# Altium schematic sheet Audio-Beamformer_HMI_V1.0.SchDoc: Audio-Beamformer
size A4; PageSetup: Record=PageOptions|CenterHorizontal=True|CenterVertical=True|PrintScale=0.97|XCorrection=1.00|YCorrection=1.00|PrintKind=0|BorderSize=5000000|LeftOffset=0|BottomOffset=0|Orientation=2|PaperLength=1000|PaperWidth=1000|Scale=100|PaperSource=7|PrintQuality=-3|MediaType=1|DitherType=10|PrintScaleMode=1|PaperKind=A4|PaperIndex=9; Organization: Ostschweizer Fachhochschule; Address2: Florian Baumgartner & Thierry Schwaller; Address3: florian.baumgartner@ost.ch; DocumentNumber: 8; Revision: V1.0; SheetNumber: 8; SheetTotal: 10; Author: Florian Baumgartner & Thierry Schwaller; Subtitle: HMI
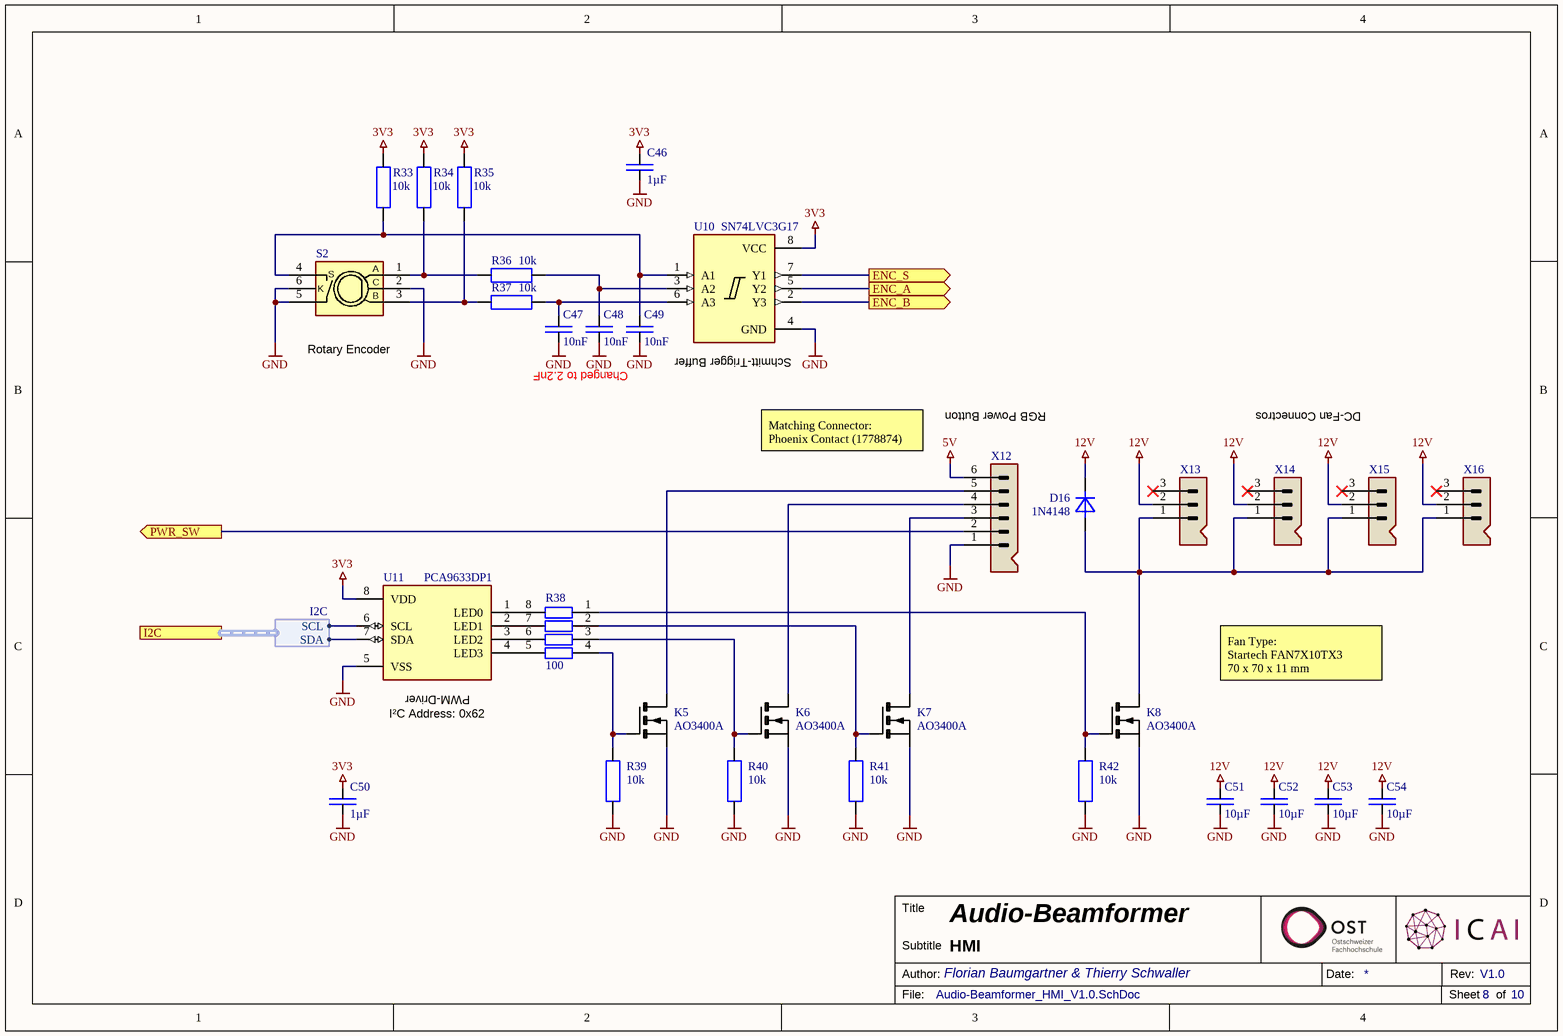
[diagram p0: Audio-Beamformer_HMI_V1.0.SchDoc]

## Parts
C46  1µF  [SMD Keramikkondensator 0603]
C47  10nF  [SMD Keramikkondensator 0603]
C48  10nF  [SMD Keramikkondensator 0603]
C49  10nF  [SMD Keramikkondensator 0603]
C50  1µF  [SMD Keramikkondensator 0603]
C51  10µF  [SMD Keramikkondensator 1206]
C52  10µF  [SMD Keramikkondensator 1206]
C53  10µF  [SMD Keramikkondensator 1206]
C54  10µF  [SMD Keramikkondensator 1206]
D16  1N4148  [SMD Diode SOD-123]
K5  AO3400A  [SMD MOSFET SOT-23]
K6  AO3400A  [SMD MOSFET SOT-23]
K7  AO3400A  [SMD MOSFET SOT-23]
K8  AO3400A  [SMD MOSFET SOT-23]
R33  10k  [SMD Widerstand 0603]
R34  10k  [SMD Widerstand 0603]
R35  10k  [SMD Widerstand 0603]
R36  10k  [SMD Widerstand 0603]
R37  10k  [SMD Widerstand 0603]
R38  100  [SMD Widerstand Array 4-Fach 0603]
R39  10k  [SMD Widerstand 0603]
R40  10k  [SMD Widerstand 0603]
R41  10k  [SMD Widerstand 0603]
R42  10k  [SMD Widerstand 0603]
S2  PEC11R-4025F-S0024  [THT Rotary Encoder with Switch]  (value not drawn)
U10  SN74LVC3G17  [SMD IC SM-8]
U11  PCA9633DP1  [SMD IC TSSOP-8]
X12  Board-To-Wire Connector (Receptacle)  [THT Connector 2.5mm 6-Pol (1778667)]  (value not drawn)
X13  Stiftleiste (3-Fach)  [THT Connector 2.54mm 3-Pol (61900311021)]  (value not drawn)
X14  Stiftleiste (3-Fach)  [THT Connector 2.54mm 3-Pol (61900311021)]  (value not drawn)
X15  Stiftleiste (3-Fach)  [THT Connector 2.54mm 3-Pol (61900311021)]  (value not drawn)
X16  Stiftleiste (3-Fach)  [THT Connector 2.54mm 3-Pol (61900311021)]  (value not drawn)

## Ports
ENC_A (out), ENC_B (out), ENC_S (out), I2C (harness I2C), PWR_SW (out)

## Harnesses
I2C: SCL, SDA

## Nets
3V3: C46.2 C50.2 R33.2 R34.2 R35.2 U10.8(VCC) U11.8(VDD)
5V: X12.6
12V: C51.2 C52.2 C53.2 C54.2 D16.K X13.2 X14.2 X15.2 X16.2
GND: C46.1 C47.1 C48.1 C49.1 C50.1 C51.1 C52.1 C53.1 C54.1 K5.S K6.S K7.S K8.S R39.1 R40.1 R41.1 R42.1 S2.2(C) S2.5(S) S2.6(K) U10.4(GND) U11.5(VSS) X12.1
ENC_A: U10.5(Y2) ; port ENC_A
ENC_B: U10.2(Y3) ; port ENC_B
ENC_S: U10.7(Y1) ; port ENC_S
PWR_SW: X12.2 ; port PWR_SW
NetC47_2: C47.2 R37.1 U10.6(A3)
NetC48_2: C48.2 R36.1 U10.3(A2)
NetC49_2: C49.2 R33.1 S2.4(S) U10.1(A1)
NetD16_A: D16.A K8.D X13.1 X14.1 X15.1 X16.1
NetK5_D: K5.D X12.5
NetK5_G: K5.G R38.4 R39.2
NetK6_D: K6.D X12.4
NetK6_G: K6.G R38.3 R40.2
NetK7_D: K7.D X12.3
NetK7_G: K7.G R38.2 R41.2
NetK8_G: K8.G R38.1 R42.2
NetR34_1: R34.1 R36.2 S2.1(A)
NetR35_1: R35.1 R37.2 S2.3(B)
NetR38_5: R38.5 U11.4(LED3)
NetR38_6: R38.6 U11.3(LED2)
NetR38_7: R38.7 U11.2(LED1)
NetR38_8: R38.8 U11.1(LED0)
NetU11_6: U11.6(SCL) ; port I2C.SCL
NetU11_7: U11.7(SDA) ; port I2C.SDA

Not connected (* = marked no-connect by the designer): X13 3*; X14 3*; X15 3*; X16 3*

## Notes on the sheet
- (near S2) Rotary Encoder
- Changed to 2.2nF
- Schmitt-Trigger Buffer
- Matching Connector:
  Phoenix Contact (1778874)
- RGB Power Button
- DC-Fan Connectros
- (near U11) PWM-Driver
- (near U11) I²C Address: 0x62
- Fan Type:
  Startech FAN7X10TX3
  70 x 70 x 11 mm
- Title
- Author:
- Subtitle
- Date:
- Rev:
- File:
- Sheet
- of

## Library data of the parts
C46 C50 = C-CAPACITOR: CAP-MK; Component Description: Multilayer Ceramic Capacitors; Component Value: 1µF 50V; Digikey: 1276-1860-1-ND; Farnell: 3013383; Mouser: 187-CL10A105KB8NNNC; JLC-Parts: C15849; Unit Price: 0.01
C47-C49 = C-CAPACITOR: CAP-MK; Component Description: Multilayer Ceramic Capacitors; Component Value: 10nF 50V; Digikey: 445-5662-1-ND; Farnell: 2346966; Mouser: 77-VJ0603V103ZXAPBC; JLC-Parts: C57112; Unit Price: 0.01
C51-C54 = C-CAPACITOR: CAP-MK; Component Description: Multilayer Ceramic Capacitors; Component Value: 10µF 50V; Digikey: 445-7886-1-ND; Farnell: 2211092; Mouser: 810-CGA5L3X5R1H106K; JLC-Parts: C13585; Unit Price: 0.27
D16 = R-DIODE: DIODE (alt V); Component Description: Fast Switching Diode; Component Value: 1N4148WTR; Digikey: 1655-1360-1-ND; Farnell: 2306363; Mouser: 750-1N4148W-HF; ComponentLink1Description: Datasheet; ComponentLink1URL: https://datasheet.lcsc.com/lcsc/1811061725_ST-Semtech-1N4148W_C81598.pdf; JLC-Parts: C81598; Unit Price: 0.01
K5-K8 = K-FET:NIGE: MOSFET N-Channel; Digikey: 785-1000-1-ND; ComponentLink1Description: Datasheet; ComponentLink1URL: http://www.aosmd.com/pdfs/datasheet/AO3400A.pdf; Component Description: MOSFET N-Channel; Component Value: AO3400A; JLC-Parts: C20917; Unit Price: 0.20
R33-R37 R39-R42 = R-RESISTOR: RES (E=Heizwiderstand B=Messwandler); Component Description: Thick Film Chip Resistor; Component Value: 10k (75V, 100mW, 1%); Digikey: P10.0KHCT-ND; Farnell: 2303192; Mouser: 667-ERJ-3EKF1002V; JLC-Parts: C25804; Unit Price: 0.01
R38 = R-Array Single Quad E24 - 330: Isolated Resistor Array; Component Value: 100 (4x, 50V, 62.5mW, 5%); ComponentLink1Description: Datasheet; ComponentLink1URL: https://datasheet.lcsc.com/lcsc/1810170717_UNI-ROYAL-Uniroyal-Elec-4D03WGJ0331T5E_C12018.pdf; Digikey: Y4101CT-ND; Farnell: 2060157; JLC-Parts: C25506; Mouser: 667-EXB-V8V101JV; Unit Price: 0.01; Component Description: Isolated Resistor Array
S2 = S-Rotary Encoder: Rotary Encoder; Component Description: Rotary Encoder with Switch; Digikey: PEC11R-4025F-S0024; Mouser: 652-PEC11R4025FS0024; ComponentLink1Description: Datasheet; ComponentLink1URL: https://www.bourns.com/docs/Product-Datasheets/PEC11R.pdf; Component Value: PEC11R-4025F-S0024; Unit Price: 2.49
U10 = U-SN74LVC3G17DCTR: Tripple Schmitt-Trigger Buffer; Digikey: 296-16915-1-ND; Farnell: 595-SN74LVC3G17DCTR; Mouser: 595-SN74LVC3G17DCTR; Component Description: Tripple Schmitt-Trigger Buffer; ComponentLink1Description: Datasheet; ComponentLink1URL: https://datasheet.lcsc.com/lcsc/1809081631_Texas-Instruments-SN74LVC3G17DCTR_C18213.pdf; Component Value: SN74LVC3G17DCTR; JLC-Parts: C18213; Unit Price: 0.70
U11 = U-PCA9633DP1: I2C Quad LED-Driver; Digikey: 568-3236-1-ND; Farnell: 2759862; Mouser: 771-PCA9633DP1-T; Component Description: I2C Quad LED-Driver; ComponentLink1Description: Datasheet; ComponentLink1URL: https://datasheet.lcsc.com/lcsc/1806132321_NXP-Semicon-PCA9633DP1-118_C88381.pdf; Component Value: PCA9633DP1; JLC-Parts: C88381; Unit Price: 1.45
X12 = X-Stiftleiste (6-Fach): Component Value: PTSM 0,5/ 6-HH-2,5-THR R32; Digikey: 277-2312-1-ND; Farnell: 3240578; Mouser: 651-1778667; Component Description: Board-To-Wire Connector (Receptacle); ComponentLink1Description: Datasheet; ComponentLink1URL: https://4donline.ihs.com/images/VipMasterIC/IC/PCON/PCONS21961/PCONS22028-1.pdf?hkey=52A5661711E402568146F3353EA87419; Unit Price: 1.42
X13-X16 = X-Stiftleiste (3-Fach): Component Description: Board-To-Wire Connector (Receptacle); Component Value: 61900311021; Digikey: 732-2700-ND; Farnell: 1841372; Mouser: 710-61900311021; ComponentLink1Description: Datasheet; ComponentLink1URL: https://www.farnell.com/datasheets/2977292.pdf; Unit Price: 0.58